# EAGLE design lcd-full (EAGLE 5.11)
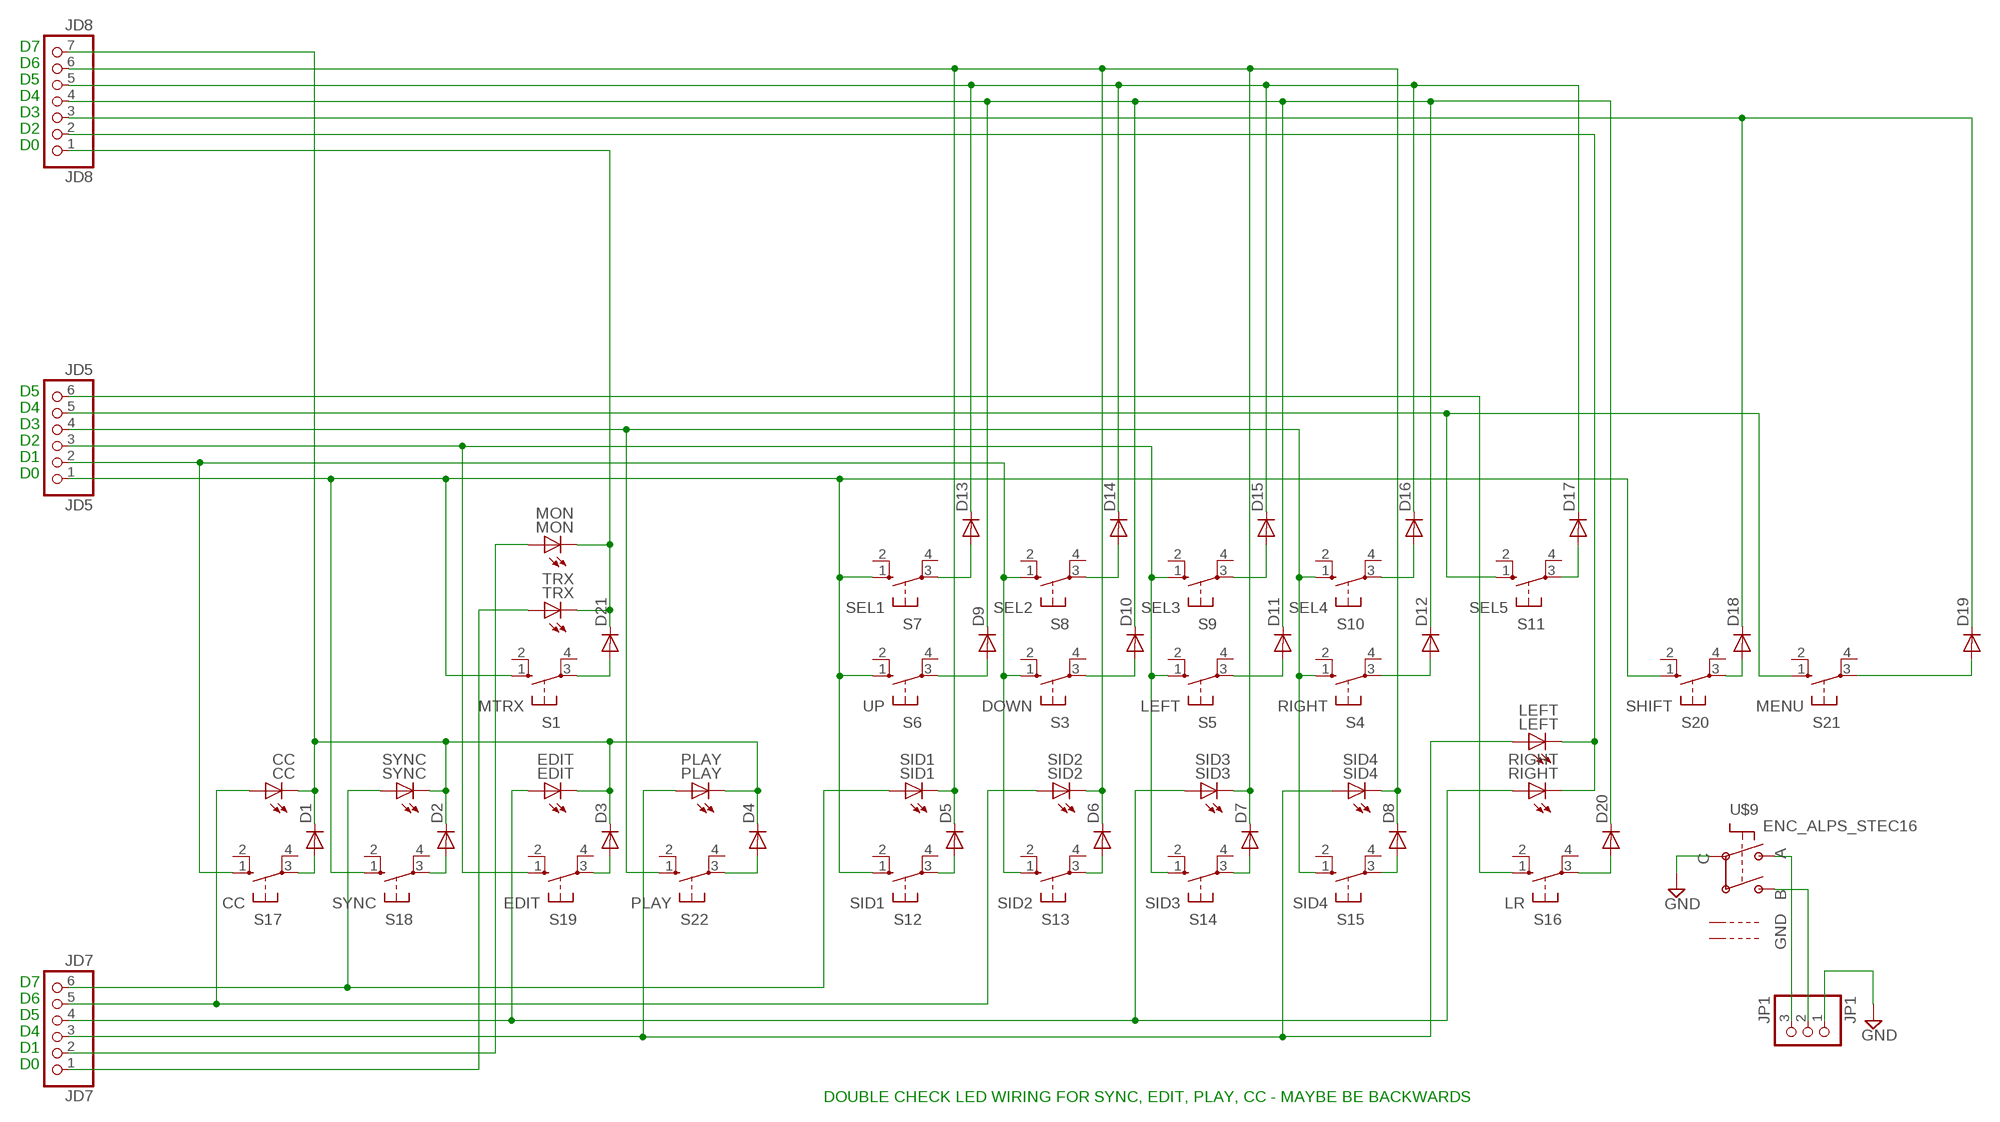
[diagram p0: schematic, sheet 1]

## Parts
CC  CC  LED3MM  [LED3MM]
D1  DIODE-DO214AA  [DO214AA]
D2  DIODE-DO214AA  [DO214AA]
D3  DIODE-DO214AA  [DO214AA]
D4  DIODE-DO214AA  [DO214AA]
D5  DIODE-DO214AA  [DO214AA]
D6  DIODE-DO214AA  [DO214AA]
D7  DIODE-DO214AA  [DO214AA]
D8  DIODE-DO214AA  [DO214AA]
D9  DIODE-DO214AA  [DO214AA]
D10  DIODE-DO214AA  [DO214AA]
D11  DIODE-DO214AA  [DO214AA]
D12  DIODE-DO214AA  [DO214AA]
D13  DIODE-DO214AA  [DO214AA]
D14  DIODE-DO214AA  [DO214AA]
D15  DIODE-DO214AA  [DO214AA]
D16  DIODE-DO214AA  [DO214AA]
D17  DIODE-DO214AA  [DO214AA]
D18  DIODE-DO214AA  [DO214AA]
D19  DIODE-DO214AA  [DO214AA]
D20  DIODE-DO214AA  [DO214AA]
D21  DIODE-DO214AA  [DO214AA]
EDIT  EDIT  LED3MM  [LED3MM]
JD5  JD5  PINHD-1X6  [1X06]
JD7  JD7  PINHD-1X6  [1X06]
JD8  JD8  PINHD-1X7  [1X07]
JP1  JP1  PINHD-1X3  [1X03]
LEFT  LEFT  LED3MM  [LED3MM]
MON  MON  LED3MM  [LED3MM]
PLAY  PLAY  LED3MM  [LED3MM]
RIGHT  RIGHT  LED3MM  [LED3MM]
S1  MTRX  10-XX  [B3F-10XX]
S3  DOWN  10-XX  [B3F-10XX]
S4  RIGHT  10-XX  [B3F-10XX]
S5  LEFT  10-XX  [B3F-10XX]
S6  UP  10-XX  [B3F-10XX]
S7  SEL1  10-XX  [B3F-10XX]
S8  SEL2  10-XX  [B3F-10XX]
S9  SEL3  10-XX  [B3F-10XX]
S10  SEL4  10-XX  [B3F-10XX]
S11  SEL5  10-XX  [B3F-10XX]
S12  SID1  10-XX  [B3F-10XX]
S13  SID2  10-XX  [B3F-10XX]
S14  SID3  10-XX  [B3F-10XX]
S15  SID4  10-XX  [B3F-10XX]
S16  LR  10-XX  [B3F-10XX]
S17  CC  10-XX  [B3F-10XX]
S18  SYNC  10-XX  [B3F-10XX]
S19  EDIT  10-XX  [B3F-10XX]
S20  SHIFT  10-XX  [B3F-10XX]
S21  MENU  10-XX  [B3F-10XX]
S22  PLAY  10-XX  [B3F-10XX]
SID1  SID1  LED3MM  [LED3MM]
SID2  SID2  LED3MM  [LED3MM]
SID3  SID3  LED3MM  [LED3MM]
SID4  SID4  LED3MM  [LED3MM]
SYNC  SYNC  LED3MM  [LED3MM]
TRX  TRX  LED3MM  [LED3MM]
U$9  ENC_ALPS_STEC16  [STEC16]

## Nets
GND: JP1.1 U$9.P$C
N$1: JP1.3 U$9.P$A
N$2: JP1.2 U$9.P$B
N$3: D21.C JD8.1 MON.K(C) TRX.K(C)
N$4: D18.C D19.C JD8.3
N$5: D13.C D14.C D15.C D16.C D17.C JD8.5
N$6: D9.C D10.C D11.C D12.C D20.C JD8.4
N$7: JD5.2 S3.1(S) S8.1(S) S13.1(S) S17.1(S)
N$8: JD5.1 S1.1(S) S6.1(S) S7.1(S) S12.1(S) S18.1(S) S20.1(S)
N$9: D5.C D6.C D7.C D8.C JD8.6 SID1.K(C) SID2.K(C) SID3.K(C) SID4.K(C)
N$10: JD5.3 S5.1(S) S9.1(S) S14.1(S) S19.1(S)
N$11: JD8.2 LEFT.K(C) RIGHT.K(C)
N$12: CC.K(C) D1.C D2.C D3.C D4.C EDIT.K(C) JD8.7 PLAY.K(C) SYNC.K(C)
N$13: JD5.4 S4.1(S) S10.1(S) S15.1(S) S22.1(S)
N$14: JD5.6 S16.1(S)
N$15: JD7.1 TRX.A
N$16: JD7.2 MON.A
N$17: JD5.5 S11.1(S) S21.1(S)
N$18: CC.A JD7.5 SID2.A
N$19: JD7.6 SID1.A SYNC.A
N$20: EDIT.A JD7.4 RIGHT.A SID3.A
N$21: JD7.3 LEFT.A PLAY.A SID4.A
N$22: D1.A S17.3(P)
N$23: D2.A S18.3(P)
N$24: D3.A S19.3(P)
N$25: D4.A S22.3(P)
N$26: D5.A S12.3(P)
N$27: D6.A S13.3(P)
N$28: D7.A S14.3(P)
N$29: D8.A S15.3(P)
N$30: D9.A S6.3(P)
N$31: D10.A S3.3(P)
N$32: D11.A S5.3(P)
N$33: D12.A S4.3(P)
N$34: D13.A S7.3(P)
N$35: D14.A S8.3(P)
N$36: D15.A S9.3(P)
N$37: D16.A S10.3(P)
N$38: D17.A S11.3(P)
N$39: D18.A S20.3(P)
N$40: D19.A S21.3(P)
N$41: D20.A S16.3(P)
N$42: D21.A S1.3(P)
Unconnected: S1.2(S1) S1.4(P1) S3.2(S1) S3.4(P1) S4.2(S1) S4.4(P1) S5.2(S1) S5.4(P1) S6.2(S1) S6.4(P1) S7.2(S1) S7.4(P1) S8.2(S1) S8.4(P1) S9.2(S1) S9.4(P1) S10.2(S1) S10.4(P1) S11.2(S1) S11.4(P1) S12.2(S1) S12.4(P1) S13.2(S1) S13.4(P1) S14.2(S1) S14.4(P1) S15.2(S1) S15.4(P1) S16.2(S1) S16.4(P1) S17.2(S1) S17.4(P1) S18.2(S1) S18.4(P1) S19.2(S1) S19.4(P1) S20.2(S1) S20.4(P1) S21.2(S1) S21.4(P1) S22.2(S1) S22.4(P1) U$9.P$GND1 U$9.P$GND2

## Notes on the sheet
- D7
- D6
- D5
- D4
- D3
- D2
- D0
- D5
- D4
- D3
- D2
- D1
- D0
- D7
- D6
- D5
- D4
- D1
- D0
- DOUBLE CHECK LED WIRING FOR SYNC, EDIT, PLAY, CC - MAYBE BE BACKWARDS

## Library data of the parts
CC EDIT LEFT MON PLAY RIGHT SID1-SID4 SYNC TRX = led:LED: LED OSRAM: - CHIPLED LG R971, LG N971, LY N971, LG Q971, LY Q971, LO R971, LY R971 LH N974, LH R974 LS Q976, LO Q976, LY Q976 LO Q996 - Hyper CHIPLED LW Q18S LB Q993, LB Q99A, LB R99A - SideLED LS A670, LO A670, LY A670, LG A670, LP A670 LB A673, LV A673, LT A673, LW A673 LH A674 LY A675 LS A676, LA A676, LO A676, LY A676, LW A676 LS A679, LY A679, LG A679 - Hyper Micro SIDELED® LS Y876, LA Y876, LO Y876, LY Y876 LT Y87S - SmartLED LW L88C, LW L88S LB L89C, LB L89S, LG L890 LS L89K, LO L89K, LY L89K LS L896, LA L896, LO L896, LY L896 - TOPLED LS T670, LO T670, LY T670, LG T670, LP T670 LSG T670, LSP T670, LSY T670, LOP T670, LYG T670 LG T671, LOG T671, LSG T671 LB T673, LV T673, LT T673, LW T673 LH T674 LS T676, LA T676, LO T676, LY T676, LB T676, LH T676, LSB T676, LW T676 LB T67C, LV T67C, LT T67C, LS T67K, LO T67K, LY T67K, LW E67C LS E67B, LA E67B, LO E67B, LY E67B, LB E67C, LV E67C, LT E67C LW T67C LS T679, LY T679, LG T679 LS T770, LO T770, LY T770, LG T770, LP T770 LB T773, LV T773, LT T773, LW T773 LH T774 LS E675, LA E675, LY E675, LS T675 LS T776, LA T776, LO T776, LY T776, LB T776 LHGB T686 LT T68C, LB T68C - Hyper Mini TOPLED® LB M676 - Mini TOPLED Santana® LG M470 LS M47K, LO M47K, LY M47K Source: http://www.osram.convergy.de LUXEON: - LUMILED® LXK2-PW12-R00, LXK2-PW12-S00, LXK2-PW14-U00, LXK2-PW14-V00 LXK2-PM12-R00, LXK2-PM12-S00, LXK2-PM14-U00 LXK2-PE12-Q00, LXK2-PE12-R00, LXK2-PE12-S00, LXK2-PE14-T00, LXK2-PE14-U00 LXK2-PB12-K00, LXK2-PB12-L00, LXK2-PB12-M00, LXK2-PB14-N00, LXK2-PB14-P00, LXK2-PB14-Q00 LXK2-PR12-L00, LXK2-PR12-M00, LXK2-PR14-Q00, LXK2-PR14-R00 LXK2-PD12-Q00, LXK2-PD12-R00, LXK2-PD12-S00 LXK2-PH12-R00, LXK2-PH12-S00 LXK2-PL12-P00, LXK2-PL12-Q00, LXK2-PL12-R00 Source: www.luxeon.com KINGBRIGHT: KA-3528ASYC Source: www.kingbright.com
D1-D21 = diode:DIODE-: DIODE
JD5 JD7 = pinhead:PINHD-1X6: PIN HEADER
JD8 = pinhead:PINHD-1X7: PIN HEADER
JP1 = pinhead:PINHD-1X3: PIN HEADER
S1 S3-S22 = switch-omron:10-XX: OMRON SWITCH; MPN: B3F-1000; OC_FARNELL: 176432; OC_NEWARK: 36M3542
U$9 = encoder:ENC

## Board
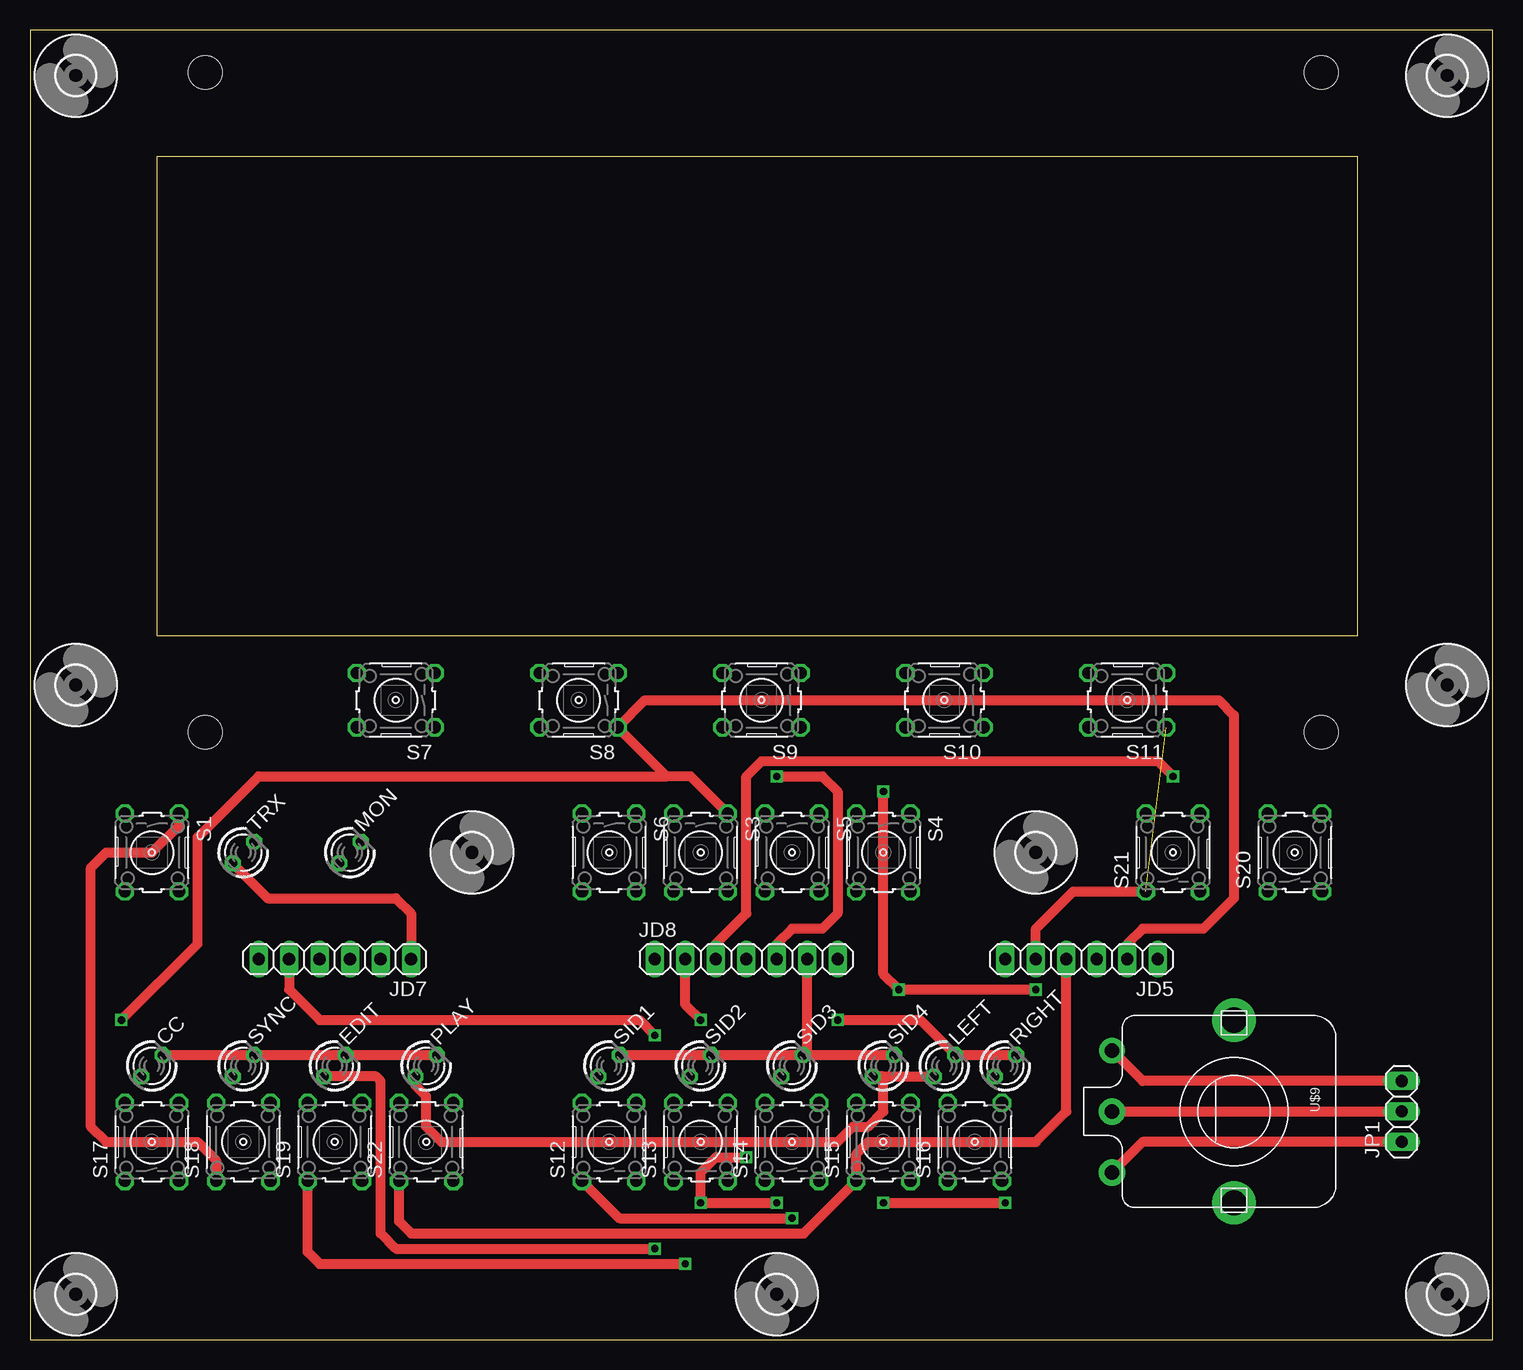
[diagram p1: board, top side]
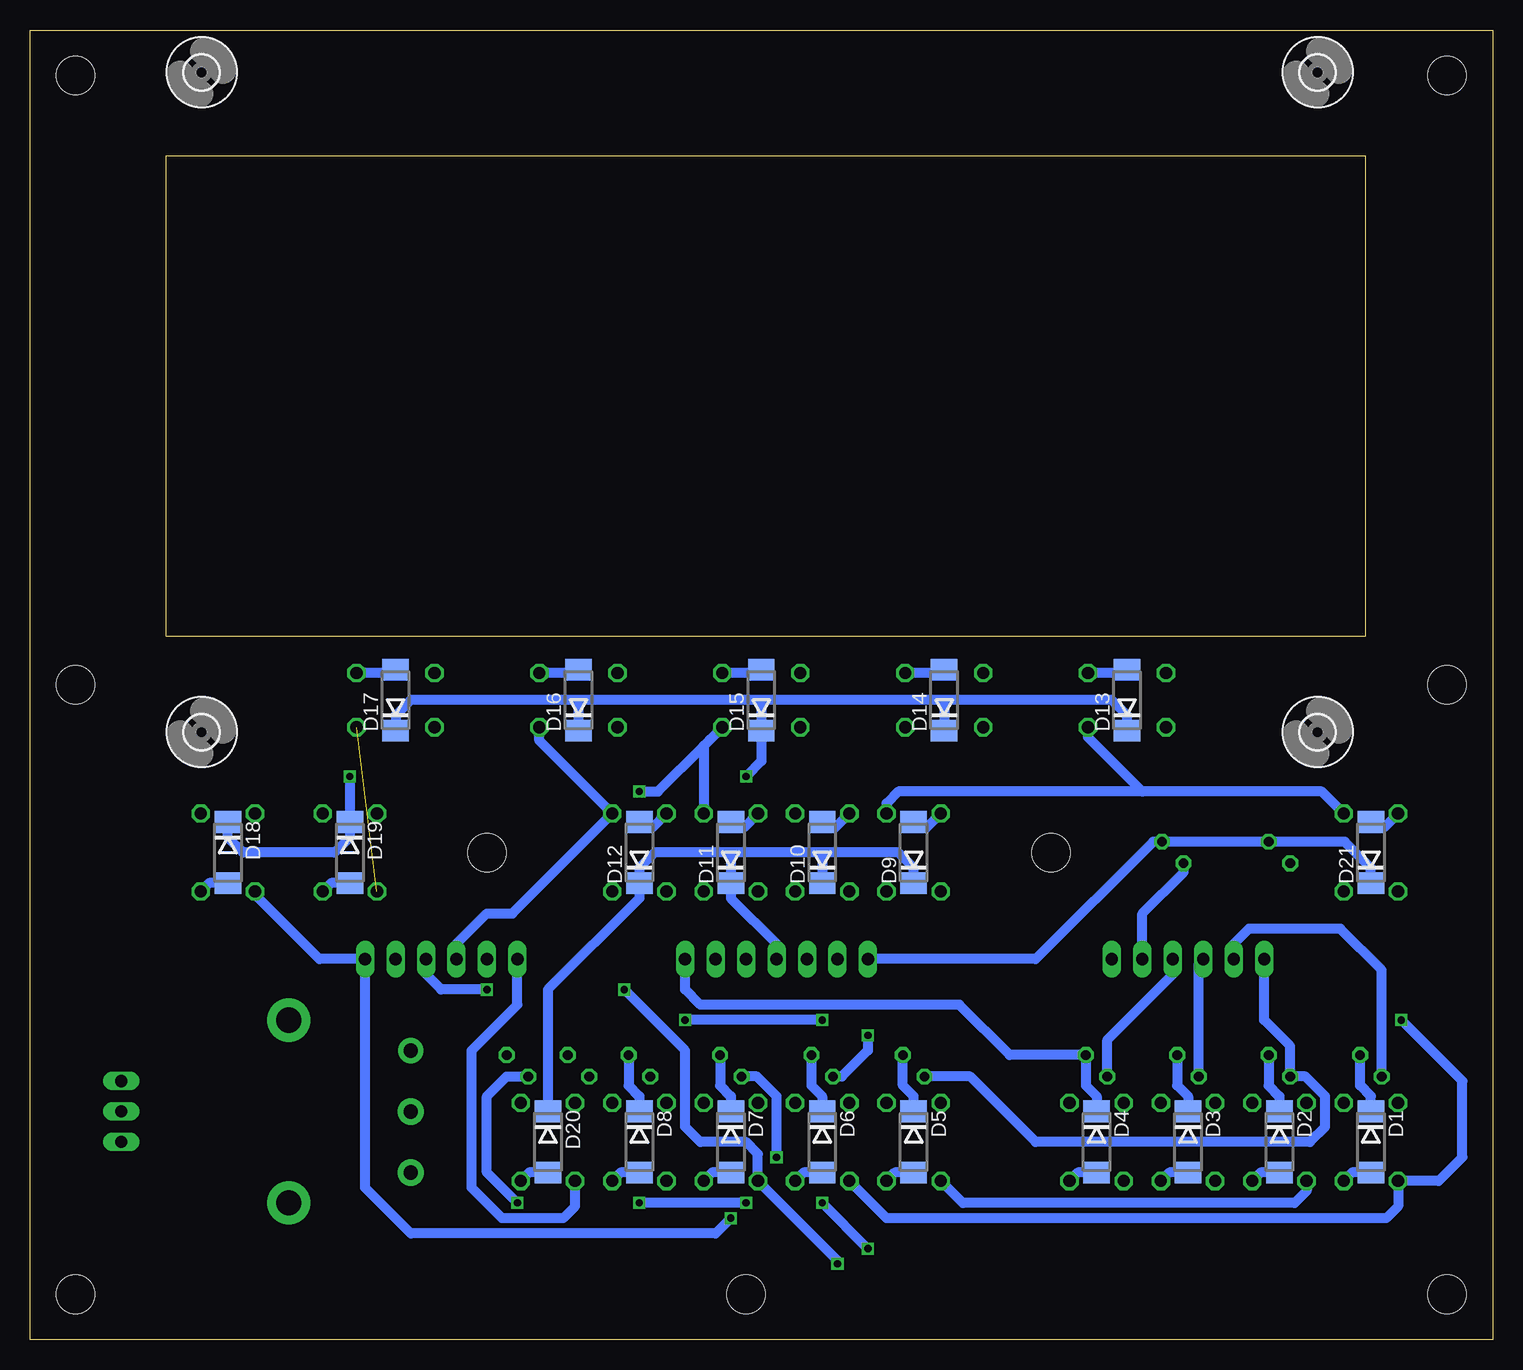
[diagram p2: board, bottom side, seen from below]

Size 121.9 x 109.21 mm. Coordinates in mm from the lower left corner, seen from the top.
Outline: 0,0 121.9,0 121.9,109.21 0,109.21 0,0
Outline: 110.6,98.67 110.6,58.67 10.6,58.67 10.6,98.67 110.6,98.67
Copper layers (1*16): Top 0.035mm / dielectric 1.5mm / Bottom 0.035mm
Design rules "default *": minimum track width 10mil, minimum drill 20mil, track to track 8mil, track to pad 8mil, pad to pad 8mil, via to via 8mil, smd to smd 8mil, copper to edge 40mil, drill to drill 8mil, minimum pad ring 10mil, minimum via ring 8mil, stop-mask expansion 4mil, vias tented up to drill 0mil, thermal gap 10mil

### Footprints (pad centres in the part's own frame; a part is rotated, then mirrored left to right if it is on the bottom)
LED3MM = drill 0.813 octagon: A -1.27,0; K 1.27,0
DO214AA = smd 1.8 x 2.2: A 2.55,0; C -2.55,0
1X06 = drill 1.016 long: 1 -6.35,0; 2 -3.81,0; 3 -1.27,0; 4 1.27,0; 5 3.81,0; 6 6.35,0
1X07 = drill 1.016 long: 1 -7.62,0; 2 -5.08,0; 3 -2.54,0; 4 0,0; 5 2.54,0; 6 5.08,0; 7 7.62,0
1X03 = drill 1.016 long: 1 -2.54,0; 2 0,0; 3 2.54,0
B3F-10XX = drill 1.016 octagon: 1 -3.251,2.261; 2 3.251,2.261; 3 -3.251,-2.261; 4 3.251,-2.261
3,2 = hole 3.2: 0,0
2,8 = hole 2.8: 0,0
STEC16 = drill 1.2 pad 2.1 round: P$A -5.08,-10.16 | drill 1.2 pad 2.2 round: P$B 0,-10.16; P$C 5.08,-10.16 | drill 2.1 pad 3.6 round: P$GND1 -7.62,0; P$GND2 7.62,0

### Placement (x,y rotation side)
CC  10.16,22.86 45 top
D1  10.16,16.51 270 bottom
D2  17.78,16.51 270 bottom
D3  25.4,16.51 270 bottom
D4  33.02,16.51 270 bottom
D5  48.26,16.51 270 bottom
D6  55.88,16.51 270 bottom
D7  63.5,16.51 270 bottom
D8  71.12,16.51 270 bottom
D9  48.26,40.64 90 bottom
D10  55.88,40.64 90 bottom
D11  63.5,40.64 90 bottom
D12  71.12,40.64 90 bottom
D13  30.48,53.34 90 bottom
D14  45.72,53.34 90 bottom
D15  60.96,53.34 90 bottom
D16  76.2,53.34 90 bottom
D17  91.44,53.34 90 bottom
D18  105.41,40.64 270 bottom
D19  95.25,40.64 270 bottom
D20  78.74,16.51 270 bottom
D21  10.16,40.64 90 bottom
EDIT  25.4,22.86 45 top
JD5  87.63,31.75 180 top
JD7  25.4,31.75 180 top
JD8  59.69,31.75 0 top
JP1  114.3,19.05 90 top
LEFT  76.2,22.86 45 top
MON  26.67,40.64 45 top
PLAY  33.02,22.86 45 top
RIGHT  81.28,22.86 45 top
S1  10.16,40.64 270 top
S3  55.88,40.64 270 top
S4  71.12,40.64 270 top
S5  63.5,40.64 270 top
S6  48.26,40.64 270 top
S7  30.48,53.34 180 top
S8  45.72,53.34 180 top
S9  60.96,53.34 180 top
S10  76.2,53.34 180 top
S11  91.44,53.34 180 top
S12  48.26,16.51 90 top
S13  55.88,16.51 90 top
S14  63.5,16.51 90 top
S15  71.12,16.51 90 top
S16  78.74,16.51 90 top
S17  10.16,16.51 90 top
S18  17.78,16.51 90 top
S19  25.4,16.51 90 top
S20  105.41,40.64 90 top
S21  95.25,40.64 90 top
S22  33.02,16.51 90 top
SID1  48.26,22.86 45 top
SID2  55.88,22.86 45 top
SID3  63.5,22.86 45 top
SID4  71.12,22.86 45 top
SYNC  17.78,22.86 45 top
TRX  17.78,40.64 45 top
U$1  [3,2]  3.81,105.41 0 top
U$2  [3,2]  118.11,105.41 0 top
U$3  [3,2]  118.11,3.81 0 top
U$4  [3,2]  3.81,3.81 0 top
U$5  [2,8]  107.6,105.67 0 bottom
U$6  [2,8]  14.6,105.67 0 bottom
U$7  [2,8]  107.6,50.67 0 bottom
U$8  [2,8]  14.6,50.67 0 bottom
U$9  100.33,19.05 270 top
U$10  [3,2]  3.81,54.61 0 top
U$11  [3,2]  118.11,54.61 0 top
U$12  [3,2]  62.23,3.81 0 top
U$13  [3,2]  36.83,40.64 0 top
U$14  [3,2]  83.82,40.64 0 top

### Tracks (layer width: path | path; a pad name or v marks a point on that pad's centre or on a via)
GND
  Top 0.813: JP1.1 92.71,16.51 U$9.P$C
N$1
  Top 0.813: JP1.3 92.71,21.59 U$9.P$A
N$2
  Top 0.813: U$9.P$B JP1.2
N$3
  Bottom 0.813: D21.C 10.16,39.37 12.33,41.54 TRX.K MON.K 28.31,41.54 38.1,31.75 JD8.1
N$4  (via drill 0.6)
  Top 0.813: JD8.3 57.15,33.02 59.69,35.56 59.69,46.99 60.96,48.26 93.98,48.26 v95.25,46.99
  Bottom 0.813: D18.C 105.41,41.91 104.14,40.64 96.52,40.64 95.25,41.91 D19.C v95.25,46.99
N$5  (via drill 0.6)
  Top 0.813: JD8.5 62.23,33.02 63.5,34.29 66.04,34.29 67.31,35.56 67.31,45.72 66.04,46.99 v62.23,46.99
  Bottom 0.813: D13.C 30.48,52.07 31.75,53.34 45.72,53.34 | 45.72,53.34 60.96,53.34 | 60.96,53.34 76.2,53.34 | 76.2,53.34 90.17,53.34 91.44,52.07 D17.C | 76.2,53.34 D16.C | 60.96,53.34 D15.C 60.96,48.26 v62.23,46.99 | 45.72,53.34 D14.C
N$6
  Bottom 0.813: D9.C 48.26,39.37 49.53,40.64 55.88,40.64 | 55.88,40.64 63.5,40.64 | 63.5,40.64 69.85,40.64 71.12,39.37 D12.C 71.12,36.83 78.74,29.21 D20.C | 63.5,40.64 D11.C 63.5,36.83 59.69,33.02 JD8.4 | 55.88,40.64 D10.C
N$7  (via drill 0.6)
  Top 0.813: JD5.2 91.44,33.02 92.71,34.29 97.79,34.29 100.33,36.83 100.33,52.07 99.06,53.34 51.23,53.34 S8.1 53.06,46.99 | v7.62,26.67 13.97,33.02 13.97,41.91 19.05,46.99 53.06,46.99 | S3.1 55.04,46.99 53.06,46.99
  Bottom 0.813: S13.1 50.52,10.16 8.89,10.16 7.9,11.15 S17.1 4.52,13.26 2.54,15.24 2.54,21.59 v7.62,26.67
N$8  (via drill 0.6)
  Top 0.813: S1.1 12.42,42.9 10.16,40.64 6.35,40.64 5.08,39.37 5.08,17.78 6.35,16.51 13.97,16.51 15.52,14.96 S18.1 | v63.5,10.16 49.1,10.16 S12.1
  Bottom 0.813: S18.1 15.52,12.42 16.51,11.43 44.17,11.43 S12.1 | S7.1 33.73,50.24 29.21,45.72 | 29.21,45.72 14.25,45.72 S1.1 | S6.1 50.52,44.73 49.53,45.72 29.21,45.72 | S20.1 103.15,37.11 97.79,31.75 JD5.1 93.98,12.7 90.17,8.89 64.77,8.89 v63.5,10.16
N$9
  Top 0.813: SID1.K SID2.K SID3.K | SID3.K SID4.K | JD8.6 64.77,24.13 SID3.K
  Bottom 0.813: SID4.K 72.02,21.22 71.12,20.32 D8.C | SID3.K 64.4,21.22 63.5,20.32 D7.C | SID2.K 56.78,21.22 55.88,20.32 D6.C | SID1.K 49.16,21.22 48.26,20.32 D5.C
N$10  (via drill 0.6)
  Top 0.813: S19.1 23.14,7.34 24.13,6.35 v54.61,6.35 | v83.82,29.21 v72.39,29.21 71.12,30.48 v71.12,45.72
  Bottom 0.813: v54.61,6.35 54.61,6.63 S14.1 61.24,15.52 62.23,16.51 66.04,16.51 67.31,17.78 67.31,24.13 v72.39,29.21 | v83.82,29.21 87.63,29.21 88.9,30.48 JD5.3 | 65.76,49.53 S5.1 | 65.76,49.53 65.27,50.03 S9.1 | v71.12,45.72 69.57,45.72 65.76,49.53
N$11  (via drill 0.6)
  Top 0.813: RIGHT.K LEFT.K 74.19,26.67 v67.31,26.67 | JD8.2 54.61,27.94 v55.88,26.67
  Bottom 0.813: v55.88,26.67 v67.31,26.67
N$12
  Top 0.813: CC.K SYNC.K EDIT.K PLAY.K
  Bottom 0.813: JD8.7 67.31,29.21 66.04,27.94 44.45,27.94 40.27,23.76 PLAY.K 33.92,21.22 33.02,20.32 D4.C | CC.K 11.06,21.22 10.16,20.32 D1.C | SYNC.K 18.68,21.22 17.78,20.32 D2.C | EDIT.K 26.3,21.22 25.4,20.32 D3.C
N$13
  Top 0.813: S22.1 30.76,9.88 31.75,8.89 64.49,8.89 S15.1 68.86,15.52 69.85,16.51 83.82,16.51 86.36,19.05 JD5.4
  Bottom 0.813: JD5.4 86.36,33.02 83.82,35.56 81.71,35.56 S4.1 79.45,49.96 S10.1
N$14
  Bottom 0.813: S16.1 76.48,11.15 77.47,10.16 82.55,10.16 85.09,12.7 85.09,24.13 81.28,27.94 JD5.6
N$15
  Top 0.813: JD7.1 31.75,35.56 30.48,36.83 19.79,36.83 TRX.A
N$16
  Bottom 0.813: MON.A 25.77,39 29.21,35.56 JD7.2
N$17  (1 unrouted)
  Top 0.813: S21.1 86.92,37.39 83.82,34.29 JD5.5
N$18  (via drill 0.6)
  Top 0.813: JD7.5 21.59,29.21 24.13,26.67 50.8,26.67 v52.07,25.4
  Bottom 0.813: CC.A 9.26,30.85 12.7,34.29 20.32,34.29 21.59,33.02 JD7.5 | v52.07,25.4 52.07,24.13 54.24,21.96 SID2.A
N$19
  Bottom 0.813: JD7.6 19.05,26.67 16.88,24.5 SYNC.A 15.61,21.96 13.97,20.32 13.97,17.78 15.24,16.51 38.1,16.51 43.55,21.96 SID1.A
N$20  (via drill 0.6)
  Top 0.813: EDIT.A 28.84,21.96 29.21,21.59 29.21,8.89 30.48,7.62 v52.07,7.62 | v59.69,15.24 57.15,15.24 55.88,13.97 v55.88,11.43 v62.23,11.43 | v71.12,11.43 v81.28,11.43
  Bottom 0.813: EDIT.A 24.5,31.38 JD7.4 | v52.07,7.62 v55.88,11.43 | v59.69,15.24 59.69,20.32 61.33,21.96 SID3.A | RIGHT.A 82.18,21.96 83.82,20.32 83.82,13.97 v81.28,11.43 | v62.23,11.43 v71.12,11.43
N$21
  Top 0.813: 71.12,21.96 SID4.A | 71.12,21.96 LEFT.A | PLAY.A 32.12,21.22 33.02,20.32 33.02,17.78 34.29,16.51 67.31,16.51 68.58,17.78 69.85,17.78 71.12,19.05 71.12,21.96
  Bottom 0.813: PLAY.A 32.12,25.03 26.67,30.48 JD7.3
N$22
  Bottom 0.813: D1.A 11.72,13.96 S17.3
N$23
  Bottom 0.813: D2.A 19.34,13.96 S18.3
N$24
  Bottom 0.813: D3.A 26.96,13.96 S19.3
N$25
  Bottom 0.813: D4.A 34.58,13.96 S22.3
N$26
  Bottom 0.813: D5.A 49.82,13.96 S12.3
N$27
  Bottom 0.813: D6.A 57.44,13.96 S13.3
N$28
  Bottom 0.813: D7.A 65.06,13.96 S14.3
N$29
  Bottom 0.813: D8.A 72.68,13.96 S15.3
N$30
  Bottom 0.813: D9.A 47.2,42.69 S6.3
N$31
  Bottom 0.813: D10.A 54.82,42.69 S3.3
N$32
  Bottom 0.813: D11.A 62.44,42.69 S5.3
N$33
  Bottom 0.813: D12.A 70.06,42.69 S4.3
N$34
  Bottom 0.813: S7.3 30.76,55.6 D13.A
N$35
  Bottom 0.813: S8.3 46.01,55.6 D14.A
N$36
  Bottom 0.813: S9.3 61.25,55.6 D15.A
N$37
  Bottom 0.813: S10.3 76.49,55.6 D16.A
N$38
  Bottom 0.813: S11.3 91.73,55.6 D17.A
N$39
  Bottom 0.813: D18.A 106.97,38.09 S20.3
N$40
  Bottom 0.813: D19.A 96.81,38.09 S21.3
N$41
  Bottom 0.813: D20.A 80.3,13.96 S16.3
N$42
  Bottom 0.813: D21.A 9.1,42.69 S1.3